# EAGLE design devboard_kw2xd_v1.0 (EAGLE 8.4.1)
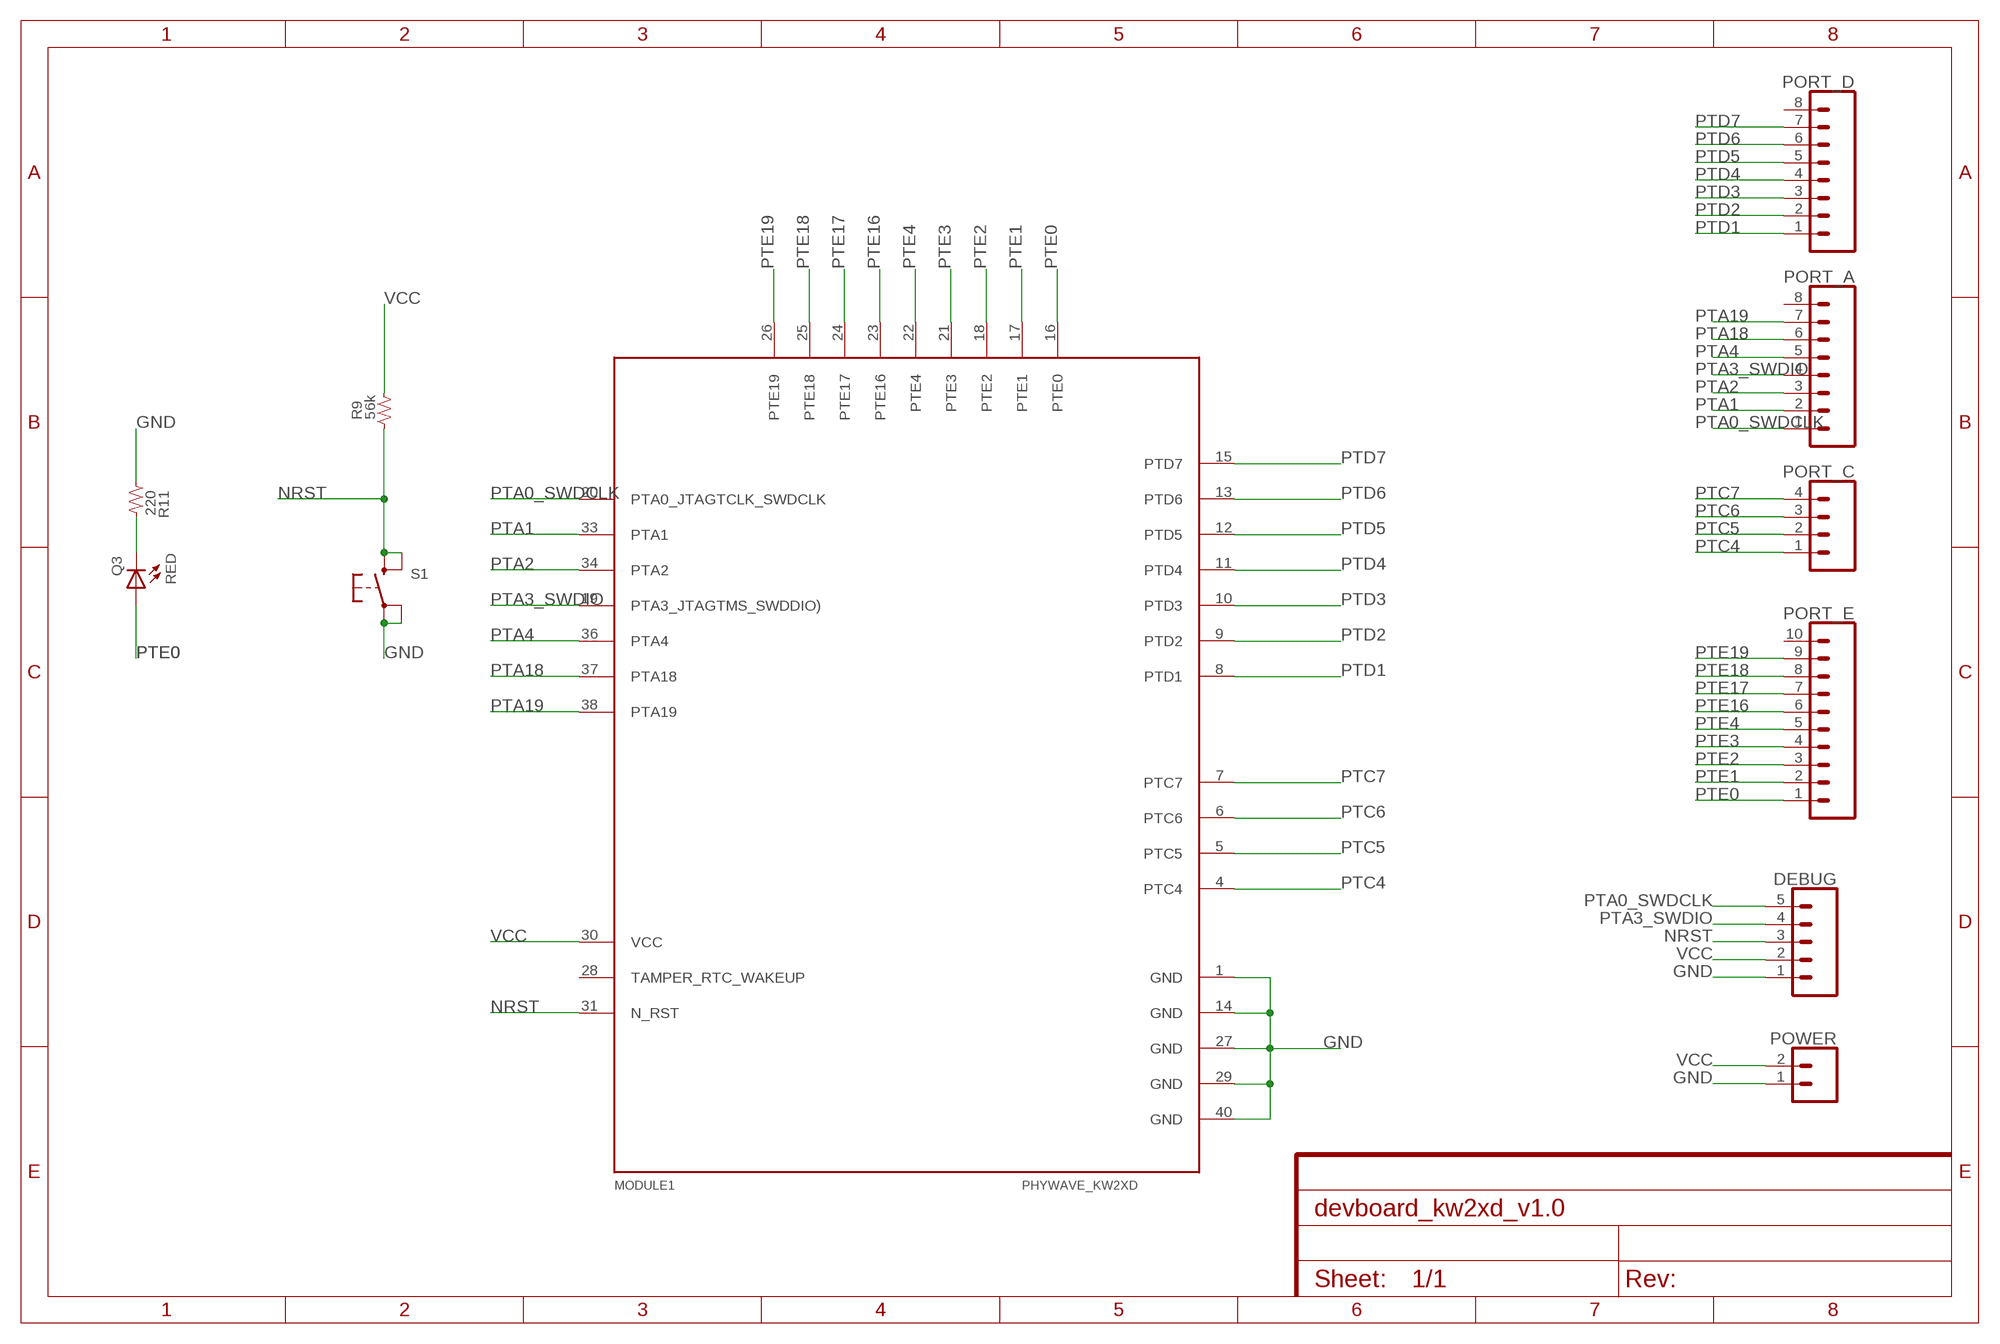
[diagram p0: schematic, sheet 1]
FRAME1 (FRAME-A4L): CNAME: OFLMote KW2xD Dev. Board; CREVISION: v1.0; DESIGNER: O.Fauchon - OFLMetrics 2018

## Parts
DEBUG  CONN_05  [1X05]
MODULE1  PHYWAVE_KW2XD  [PHYWAVE_KW2XD]
PORT_A  CONN_08"  [1X08]
PORT_C  CONN_04  [1X04]
PORT_D  CONN_08"  [1X08]
PORT_E  CONN_10"  [1X10]
POWER  CONN_02  [1X02]
Q3  RED  LED-0603  [LED0603]
R9  56k  R-0603  [SMD0603]
R11  220  R-0603  [SMD0603]
S1  SPST-MOM-KSCJ  [KSC-J]

## Nets
GND: DEBUG.1 MODULE1.1(GND) MODULE1.14(GND) MODULE1.27(GND) MODULE1.29(GND) MODULE1.40(GND) POWER.1 R11.1 S1.A1(P) S1.A2(P1)
N$20: Q3.C R11.2
NRST: DEBUG.3 MODULE1.31(N_RST) R9.1 S1.B1(S) S1.B2(S1)
PTA0_SWDCLK: DEBUG.5 MODULE1.20(PTA0_JTAGTCLK_SWDCLK) PORT_A.1
PTA1: MODULE1.33(PTA1) PORT_A.2
PTA2: MODULE1.34(PTA2) PORT_A.3
PTA3_SWDIO: DEBUG.4 MODULE1.19(PTA3_JTAGTMS_SWDDIO)) PORT_A.4
PTA4: MODULE1.36(PTA4) PORT_A.5
PTA18: MODULE1.37(PTA18) PORT_A.6
PTA19: MODULE1.38(PTA19) PORT_A.7
PTC4: MODULE1.4(PTC4) PORT_C.1
PTC5: MODULE1.5(PTC5) PORT_C.2
PTC6: MODULE1.6(PTC6) PORT_C.3
PTC7: MODULE1.7(PTC7) PORT_C.4
PTD1: MODULE1.8(PTD1) PORT_D.1
PTD2: MODULE1.9(PTD2) PORT_D.2
PTD3: MODULE1.10(PTD3) PORT_D.3
PTD4: MODULE1.11(PTD4) PORT_D.4
PTD5: MODULE1.12(PTD5) PORT_D.5
PTD6: MODULE1.13(PTD6) PORT_D.6
PTD7: MODULE1.15(PTD7) PORT_D.7
PTE0: MODULE1.16(PTE0) PORT_E.1 Q3.A
PTE1: MODULE1.17(PTE1) PORT_E.2
PTE2: MODULE1.18(PTE2) PORT_E.3
PTE3: MODULE1.21(PTE3) PORT_E.4
PTE4: MODULE1.22(PTE4) PORT_E.5
PTE16: MODULE1.23(PTE16) PORT_E.6
PTE17: MODULE1.24(PTE17) PORT_E.7
PTE18: MODULE1.25(PTE18) PORT_E.8
PTE19: MODULE1.26(PTE19) PORT_E.9
VCC: DEBUG.2 MODULE1.30(VCC) POWER.2 R9.2
Unconnected: MODULE1.28(TAMPER_RTC_WAKEUP) PORT_A.8 PORT_D.8 PORT_E.10

## Library data of the parts
DEBUG = SparkFun-Connectors:CONN_05: Multi connection point. Often used as Generic Header-pin footprint for 0.1 inch spaced/style header connections On any of the 0.1 inch spaced packages, you can populate with these: Break Away Headers - Straight <https://www.sparkfun.com/products/116> (PRT-00116) Break Away Male Headers - Right Angle <https://www.sparkfun.com/products/553> (PRT-00553) Female Headers <https://www.sparkfun.com/products/115> (PRT-00115) Break Away Headers - Machine Pin <https://www.sparkfun.com/products/117> (PRT-00117) Break Away Female Headers - Swiss Machine Pin <https://www.sparkfun.com/products/743> (PRT-00743) For SCREWTERMINALS and SPRING TERMINALS visit here: Screw Terimnals on SparkFun.com <https://www.sparkfun.com/search/results?term=Screw+Terminals> (5mm/3.5mm/2.54mm spacing) This device is also useful as a general connection point to wire up your design to another part of your project. Our various solder wires solder well into these plated through hole pads. Hook-Up Wire - Assortment (Stranded, 22 AWG) <https://www.sparkfun.com/products/11375> (PRT-11375) Hook-Up Wire - Assortment (Solid Core, 22 AWG) <https://www.sparkfun.com/products/11367> (PRT-11367) View the entire wire category on our website here <https://www.sparkfun.com/categories/141> Special notes: Molex polarized connector foot print use with SKU : PRT-08231 with associated crimp pins and housings. 1MM SMD Version SKU: PRT-10208
MODULE1 = oflabs-phytec:PHYWAVE_KW2XD
PORT_A PORT_D = SparkFun-Connectors:CONN_08: Multi connection point. Often used as Generic Header-pin footprint for 0.1 inch spaced/style header connections On any of the 0.1 inch spaced packages, you can populate with these: Break Away Headers - Straight <https://www.sparkfun.com/products/116> (PRT-00116) Break Away Male Headers - Right Angle <https://www.sparkfun.com/products/553> (PRT-00553) Female Headers <https://www.sparkfun.com/products/115> (PRT-00115) Break Away Headers - Machine Pin <https://www.sparkfun.com/products/117> (PRT-00117) Break Away Female Headers - Swiss Machine Pin <https://www.sparkfun.com/products/743> (PRT-00743) Arduino Stackable Header - 8 Pin <https://www.sparkfun.com/products/9279> (PRT-09279) For SCREWTERMINALS and SPRING TERMINALS visit here: Screw Terimnals on SparkFun.com <https://www.sparkfun.com/search/results?term=Screw+Terminals> (5mm/3.5mm/2.54mm spacing) This device is also useful as a general connection point to wire up your design to another part of your project. Our various solder wires solder well into these plated through hole pads. Hook-Up Wire - Assortment (Stranded, 22 AWG) <https://www.sparkfun.com/products/11375> (PRT-11375) Hook-Up Wire - Assortment (Solid Core, 22 AWG) <https://www.sparkfun.com/products/11367> (PRT-11367) View the entire wire category on our website here <https://www.sparkfun.com/categories/141> Special notes: Molex polarized connector foot print use with SKU : PRT-08231 with associated crimp pins and housings. 1MM SMD Version SKU: PRT-10208 NOTES ON THE VARIANTS LOCK and LOCK_LONGPADS... This footprint was designed to help hold the alignment of a through-hole component (i.e. 6-pin header) while soldering it into place. You may notice that each hole has been shifted either up or down by 0.005 of an inch from it's more standard position (which is a perfectly straight line). This slight alteration caused the pins (the squares in the middle) to touch the edges of the holes. Because they are alternating, it causes a "brace" to hold the component in place. 0.005 has proven to be the perfect amount of "off-center" position when using our standard breakaway headers. Although looks a little odd when you look at the bare footprint, once you have a header in there, the alteration is very hard to notice. Also,if you push a header all the way into place, it is covered up entirely on the bottom side.; PROD_ID: CONN-08438
PORT_C = SparkFun-Connectors:CONN_04: Multi connection point. Often used as Generic Header-pin footprint for 0.1 inch spaced/style header connections On any of the 0.1 inch spaced packages, you can populate with these: Break Away Headers - Straight <https://www.sparkfun.com/products/116> (PRT-00116) Break Away Male Headers - Right Angle <https://www.sparkfun.com/products/553> (PRT-00553) Female Headers <https://www.sparkfun.com/products/115> (PRT-00115) Break Away Headers - Machine Pin <https://www.sparkfun.com/products/117> (PRT-00117) Break Away Female Headers - Swiss Machine Pin <https://www.sparkfun.com/products/743> (PRT-00743) For SCREWTERMINALS and SPRING TERMINALS visit here: Screw Terimnals on SparkFun.com <https://www.sparkfun.com/search/results?term=Screw+Terminals> (5mm/3.5mm/2.54mm spacing) This device is also useful as a general connection point to wire up your design to another part of your project. Our various solder wires solder well into these plated through hole pads. Hook-Up Wire - Assortment (Stranded, 22 AWG) <https://www.sparkfun.com/products/11375> (PRT-11375) Hook-Up Wire - Assortment (Solid Core, 22 AWG) <https://www.sparkfun.com/products/11367> (PRT-11367) View the entire wire category on our website here <https://www.sparkfun.com/categories/141> Special notes: Molex polarized connector foot print use with SKU : PRT-08231 with associated crimp pins and housings. 1MM SMD Version SKU: PRT-10208; PROD_ID: CONN-09696
PORT_E = SparkFun-Connectors:CONN_10: Multi connection point. Often used as Generic Header-pin footprint for 0.1 inch spaced/style header connections On any of the 0.1 inch spaced packages, you can populate with these: Break Away Headers - Straight <https://www.sparkfun.com/products/116> (PRT-00116) Break Away Male Headers - Right Angle <https://www.sparkfun.com/products/553> (PRT-00553) Female Headers <https://www.sparkfun.com/products/115> (PRT-00115) Break Away Headers - Machine Pin <https://www.sparkfun.com/products/117> (PRT-00117) Break Away Female Headers - Swiss Machine Pin <https://www.sparkfun.com/products/743> (PRT-00743) Arduino Stackable Header - 10 Pin <https://www.sparkfun.com/products/11376> (PRT-11376) For SCREWTERMINALS and SPRING TERMINALS visit here: Screw Terimnals on SparkFun.com <https://www.sparkfun.com/search/results?term=Screw+Terminals> (5mm/3.5mm/2.54mm spacing) This device is also useful as a general connection point to wire up your design to another part of your project. Our various solder wires solder well into these plated through hole pads. Hook-Up Wire - Assortment (Stranded, 22 AWG) <https://www.sparkfun.com/products/11375> (PRT-11375) Hook-Up Wire - Assortment (Solid Core, 22 AWG) <https://www.sparkfun.com/products/11367> (PRT-11367) View the entire wire category on our website here <https://www.sparkfun.com/categories/141> Special notes: Molex polarized connector foot print use with SKU : PRT-08231 with associated crimp pins and housings. 1MM SMD Version SKU: PRT-10208 NOTES ON THE VARIANTS LOCK and LOCK_LONGPADS... This footprint was designed to help hold the alignment of a through-hole component (i.e. 6-pin header) while soldering it into place. You may notice that each hole has been shifted either up or down by 0.005 of an inch from it's more standard position (which is a perfectly straight line). This slight alteration caused the pins (the squares in the middle) to touch the edges of the holes. Because they are alternating, it causes a "brace" to hold the component in place. 0.005 has proven to be the perfect amount of "off-center" position when using our standard breakaway headers. Although looks a little odd when you look at the bare footprint, once you have a header in there, the alteration is very hard to notice. Also,if you push a header all the way into place, it is covered up entirely on the bottom side.; PROD_ID: CONN-11563
POWER = SparkFun-Connectors:CONN_02: Multi connection point. Often used as Generic Header-pin footprint for 0.1 inch spaced/style header connections On any of the 0.1 inch spaced packages, you can populate with these: Break Away Headers - Straight <https://www.sparkfun.com/products/116> (PRT-00116) Break Away Male Headers - Right Angle <https://www.sparkfun.com/products/553> (PRT-00553) Female Headers <https://www.sparkfun.com/products/115> (PRT-00115) Break Away Headers - Machine Pin <https://www.sparkfun.com/products/117> (PRT-00117) Break Away Female Headers - Swiss Machine Pin <https://www.sparkfun.com/products/743> (PRT-00743) For SCREWTERMINALS and SPRING TERMINALS visit here: Screw Terimnals on SparkFun.com <https://www.sparkfun.com/search/results?term=Screw+Terminals> (5mm/3.5mm/2.54mm spacing) This device is also useful as a general connection point to wire up your design to another part of your project. Our various solder wires solder well into these plated through hole pads. Hook-Up Wire - Assortment (Stranded, 22 AWG) <https://www.sparkfun.com/products/11375> (PRT-11375) Hook-Up Wire - Assortment (Solid Core, 22 AWG) <https://www.sparkfun.com/products/11367> (PRT-11367) View the entire wire category on our website here <https://www.sparkfun.com/categories/141> Special notes: Molex polarized connector foot print use with: PRT-08233 with associated crimp pins and housings. 2.54_SCREWTERM for use with PRT-10571. 3.5mm Screw Terminal footprints for PRT-08084 5mm Screw Terminal footprints for use with PRT-08432
Q3 = parts:LED
R9 R11 = parts:R
S1 = parts:SPST-MOM: Tact. Switch

## Board
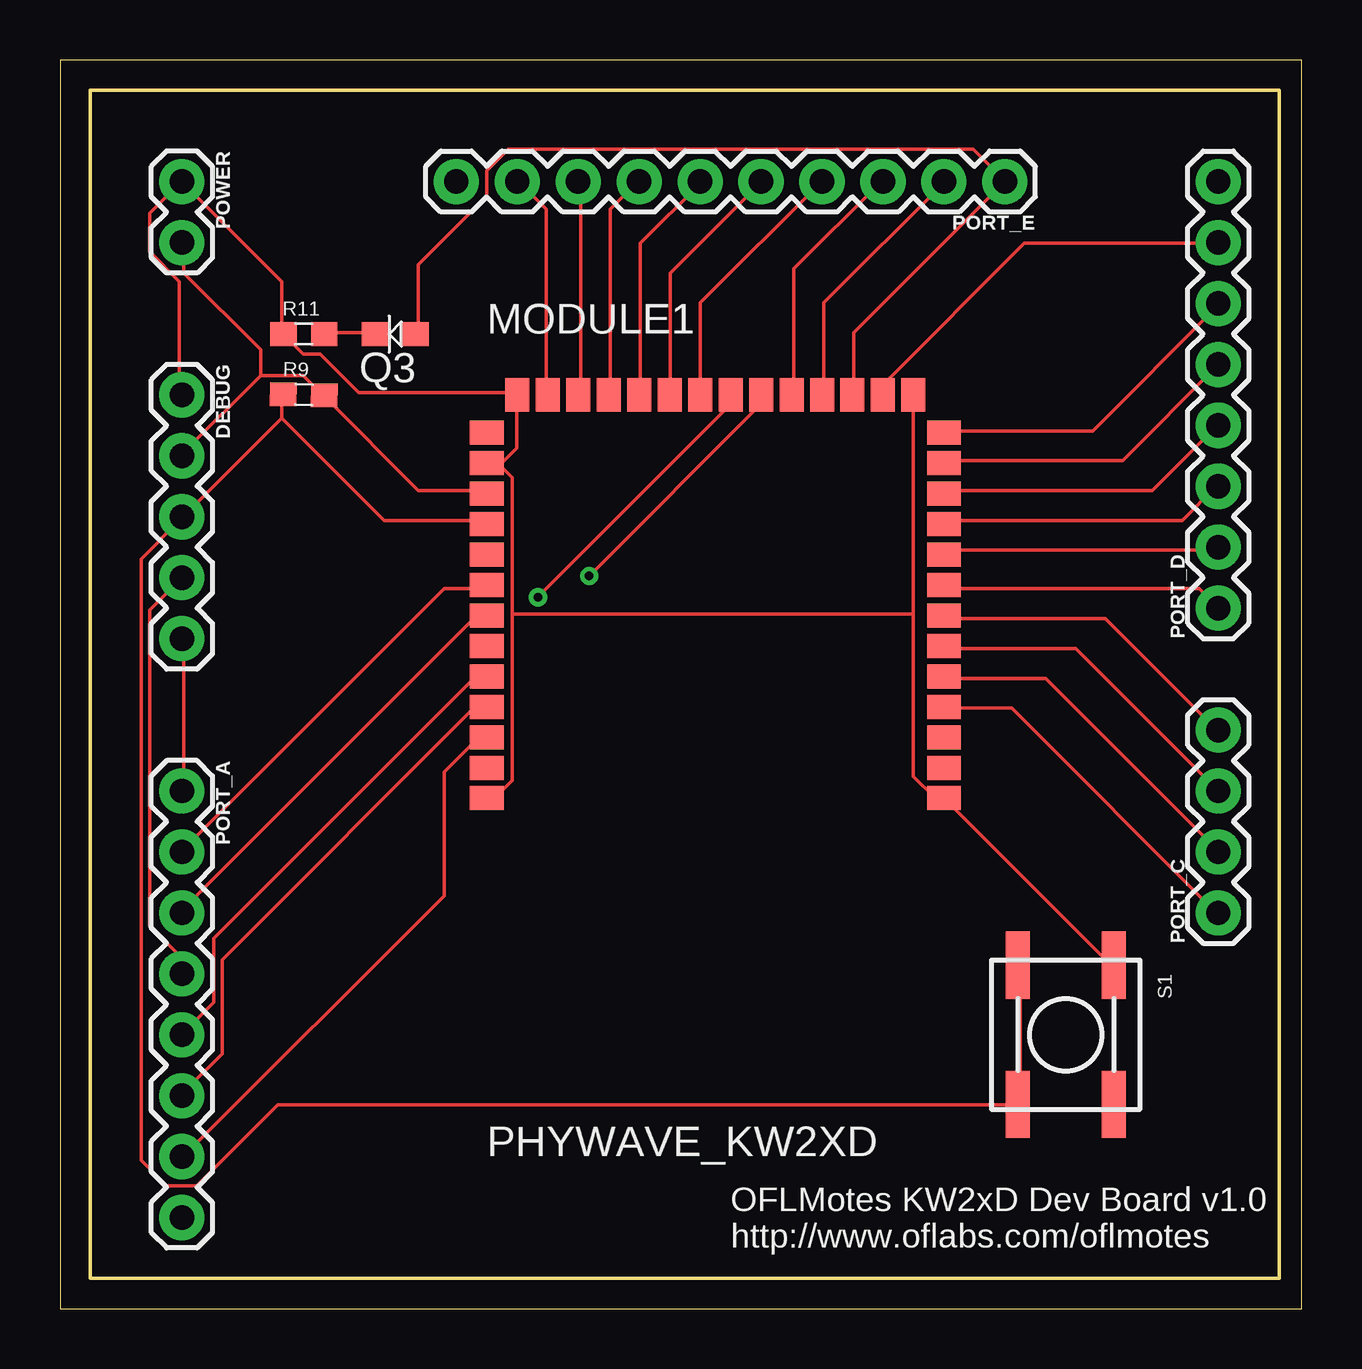
[diagram p1: board, top side]
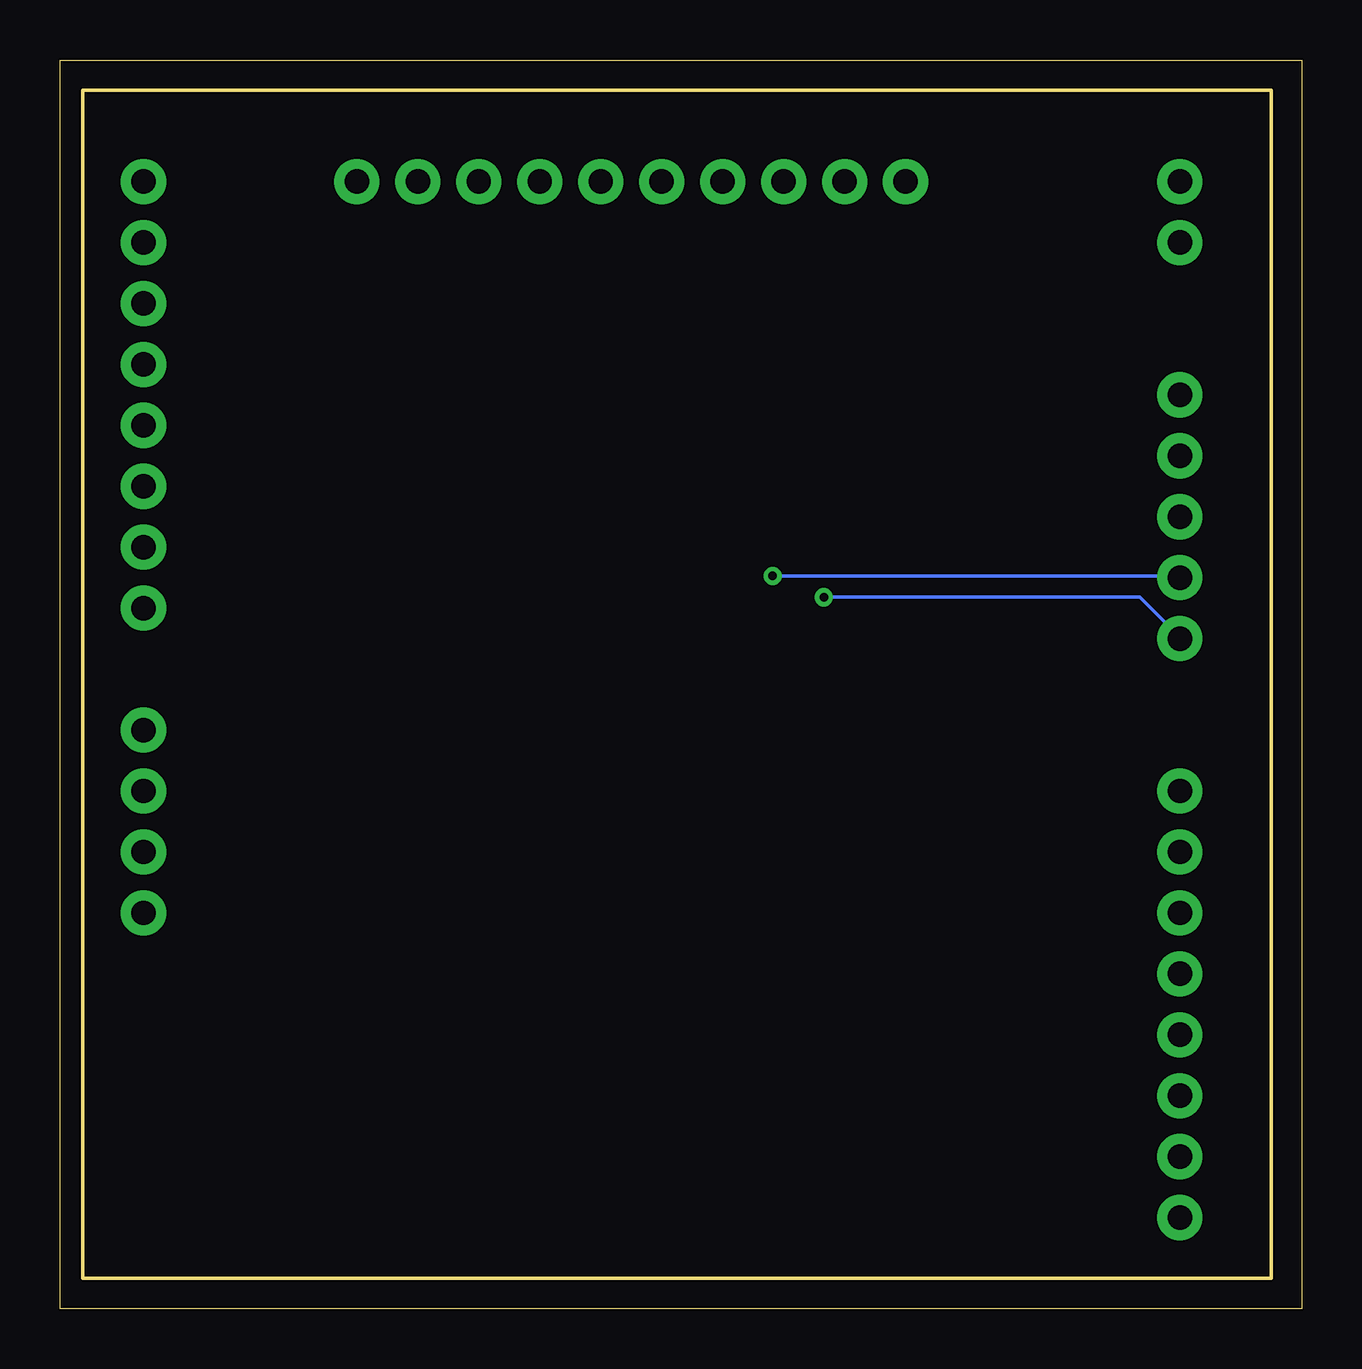
[diagram p2: board, bottom side, seen from below]

Size 51.74 x 52.06 mm. Coordinates in mm from the lower left corner, seen from the top.
Outline: 0,0 51.74,0 51.74,52.06 0,52.06 0,0
Outline: 1.27,50.8 50.8,50.8 50.8,1.27 1.27,1.27 1.27,50.8
Copper layers (1*16): Top 0.035mm / dielectric 1.5mm / Bottom 0.035mm
Design rules "default *": minimum track width 6mil, minimum drill 0.35mm, track to track 8mil, track to pad 8mil, pad to pad 8mil, via to via 8mil, smd to smd 8mil, copper to edge 40mil, drill to drill 6mil, minimum pad ring 10mil, minimum via ring 8mil, stop-mask expansion 4mil, vias tented up to drill 0mil, thermal gap 10mil

### Footprints (pad centres in the part's own frame; a part is rotated, then mirrored left to right if it is on the bottom)
1X05 = drill 1.016 pad 1.88: 1 0,0; 2 2.54,0; 3 5.08,0; 4 7.62,0; 5 10.16,0
PHYWAVE_KW2XD = smd 1.4 x 1: 1 19.05,-0.3; 2 19.05,0.97; 3 19.05,2.24; 4 19.05,3.51; 5 19.05,4.78; 6 19.05,6.05; 7 19.05,7.32; 8 19.05,8.59; 9 19.05,9.86; 10 19.05,11.13; 11 19.05,12.4; 12 19.05,13.67; 13 19.05,14.94; 28 0,14.94; 29 0,13.67; 30 0,12.4; 31 0,11.13; 32 0,9.86; 33 0,8.59; 34 0,7.32; 35 0,6.05; 36 0,4.78; 37 0,3.51; 38 0,2.24; 39 0,0.97; 40 0,-0.3 | smd 1 x 1.4: 14 17.78,16.51; 15 16.51,16.51; 16 15.24,16.51; 17 13.97,16.51; 18 12.7,16.51; 19 11.43,16.51; 20 10.16,16.51; 21 8.89,16.51; 22 7.62,16.51; 23 6.35,16.51; 24 5.08,16.51; 25 3.81,16.51; 26 2.54,16.51; 27 1.27,16.51
1X08 = drill 1.016 pad 1.88: 1 0,0; 2 2.54,0; 3 5.08,0; 4 7.62,0; 5 10.16,0; 6 12.7,0; 7 15.24,0; 8 17.78,0
1X04 = drill 1.016 pad 1.88: 1 0,0; 2 2.54,0; 3 5.08,0; 4 7.62,0
1X10 = drill 1.016 pad 1.88: 1 0,0; 2 2.54,0; 3 5.08,0; 4 7.62,0; 5 10.16,0; 6 12.7,0; 7 15.24,0; 8 17.78,0; 9 20.32,0; 10 22.86,0
1X02 = drill 1.016 pad 1.88: 1 0,0; 2 2.54,0
LED0603 = smd 1.1 x 1: A -0.85,0; C 0.85,0
SMD0603 = smd 1.1 x 1: 1 -0.85,0; 2 0.85,0
KSC-J = smd 2.8 x 1: A1 -2.9,2; A2 2.9,2; B1 -2.9,-2; B2 2.9,-2

### Placement (x,y rotation side)
DEBUG  5.08,38.1 270 top
MODULE1  17.78,21.59 0 top
PORT_A  5.08,21.59 270 top
PORT_C  48.26,16.51 90 top
PORT_D  48.26,29.21 90 top
PORT_E  39.37,46.99 180 top
POWER  5.08,46.99 270 top
Q3  13.97,40.64 180 top
R9  10.16,38.1 358.8 top
R11  10.16,40.64 0 top
S1  41.91,11.43 270 top

### Tracks (layer width: path | path; a pad name or v marks a point on that pad's centre or on a via)
GND
  Top 0.152: 35.56,28.96 35.56,22.2 36.45,21.31 36.8,21.31 MODULE1.1 36.98,21.13 43.74,14.38 S1.A1 43.92,14.2 43.92,8.69 S1.A2 | 35.56,28.96 MODULE1.14 | 18.85,28.96 18.85,34.65 18.31,35.18 | 18.85,28.96 18.85,22.02 18.14,21.31 17.78,21.31 MODULE1.40 | 18.31,35.18 17.78,35.18 MODULE1.29 18.31,35.18 | 18.31,35.18 19.02,35.89 19.02,38.02 MODULE1.27 19.02,38.2 12.45,38.2 10.85,39.8 10.13,39.8 9.42,40.51 R11.1 9.25,40.69 9.25,42.82 POWER.1 4.98,46.91 3.73,45.67 3.73,44.07 4.98,42.82 4.98,38.2 DEBUG.1 | 18.85,28.96 35.56,28.96
N$20
  Top 0.152: R11.2 11.02,40.69 12.98,40.69 Q3.C
NRST
  Top 0.152: S1.B1 40.01,14.2 40.01,8.69 S1.B2 39.83,8.51 9.07,8.51 5.69,5.13 4.45,5.13 3.38,6.2 3.38,31.27 4.98,32.87 DEBUG.3 5.16,33.05 9.25,37.14 | 9.25,37.14 9.25,38.02 R9.1 | 9.25,37.14 13.51,32.87 17.78,32.87 MODULE1.31
PTA0_SWDCLK  (via drill 0.35)
  Top 0.152: v19.91,29.67 27.91,37.67 27.91,38.02 MODULE1.20 | PORT_A.1 5.16,21.67 5.16,27.89 DEBUG.5
  Bottom 0.152: v19.91,29.67 6.76,29.67 5.16,28.07 DEBUG.5
PTA1
  Top 0.152: MODULE1.33 17.78,30.02 16,30.02 5.16,19.18 PORT_A.2
PTA2
  Top 0.152: MODULE1.34 17.78,28.78 17.25,28.78 4.98,16.51 PORT_A.3
PTA3_SWDIO  (via drill 0.35)
  Top 0.152: v22.05,30.56 29.16,37.67 29.16,38.02 MODULE1.19 | DEBUG.4 3.73,29.13 3.73,15.98 4.98,14.73 4.98,14.02 PORT_A.4
  Bottom 0.152: v22.05,30.56 5.16,30.56 DEBUG.4
PTA4
  Top 0.152: MODULE1.36 17.78,26.29 17.25,26.29 6.4,15.44 6.4,12.78 5.16,11.53 PORT_A.5
PTA18
  Top 0.152: MODULE1.37 17.78,25.04 17.25,25.04 6.76,14.55 6.76,10.64 5.16,9.04 PORT_A.6
PTA19
  Top 0.152: MODULE1.38 17.78,23.8 17.42,23.8 16,22.38 16,17.22 5.16,6.37 PORT_A.7
PTC4
  Top 0.152: MODULE1.4 36.98,25.04 39.65,25.04 48.18,16.51 PORT_C.1
PTC5
  Top 0.152: MODULE1.5 36.98,26.29 41.07,26.29 48.18,19.18 PORT_C.2
PTC6
  Top 0.152: PORT_C.3 42.32,27.53 36.98,27.53 MODULE1.6
PTC7
  Top 0.152: MODULE1.7 36.98,28.78 43.56,28.78 48.18,24.15 PORT_C.4
PTD1
  Top 0.152: MODULE1.8 36.98,30.02 47.47,30.02 48.18,29.31 PORT_D.1
PTD2
  Top 0.152: MODULE1.9 36.98,31.62 48.18,31.62 PORT_D.2
PTD3
  Top 0.152: MODULE1.10 36.98,32.87 46.76,32.87 48.18,34.29 PORT_D.3
PTD4
  Top 0.152: MODULE1.11 36.98,34.11 45.52,34.11 48.18,36.78 PORT_D.4
PTD5
  Top 0.152: MODULE1.12 36.98,35.36 44.27,35.36 48.18,39.27 PORT_D.5
PTD6
  Top 0.152: MODULE1.13 36.98,36.6 43.03,36.6 48.18,41.76 PORT_D.6
PTD7
  Top 0.152: MODULE1.15 34.31,38.2 34.31,38.56 40.18,44.42 48.18,44.42 PORT_D.7
PTE0
  Top 0.152: Q3.A 14.94,40.69 14.94,43.54 17.78,46.38 17.78,47.45 18.67,48.34 38.05,48.34 39.29,47.09 PORT_E.1 33.07,40.69 33.07,38.2 MODULE1.16
PTE1
  Top 0.152: MODULE1.17 31.83,38.2 31.83,41.94 36.8,46.91 PORT_E.2
PTE2
  Top 0.152: MODULE1.18 30.58,38.2 30.58,43.36 34.14,46.91 PORT_E.3
PTE3
  Top 0.152: MODULE1.21 26.67,41.94 31.65,46.91 PORT_E.4
PTE4
  Top 0.152: MODULE1.22 25.43,38.2 25.43,43.18 29.16,46.91 PORT_E.5
PTE16
  Top 0.152: MODULE1.23 24.18,38.2 24.18,44.42 26.67,46.91 PORT_E.6
PTE17
  Top 0.152: MODULE1.24 22.94,38.2 22.94,45.85 24,46.91 PORT_E.7
PTE18
  Top 0.152: MODULE1.25 21.69,38.2 21.69,46.91 PORT_E.8
PTE19
  Top 0.152: MODULE1.26 20.27,38.2 20.27,45.85 19.2,46.91 PORT_E.9
VCC
  Top 0.152: 8.36,38.91 10.13,38.91 10.85,38.2 R9.2 11.02,38.02 14.94,34.11 17.78,34.11 MODULE1.30 | 8.36,38.91 5.16,35.71 DEBUG.2 | 8.36,38.91 8.36,39.98 5.16,43.18 5.16,44.42 POWER.2

### Text on the board
tNames: OFLMotes KW2xD Dev Board v1.0 / http://www.oflabs.com/oflmotes